# EAGLE schematic Dimmer (EAGLE 9.1.0)
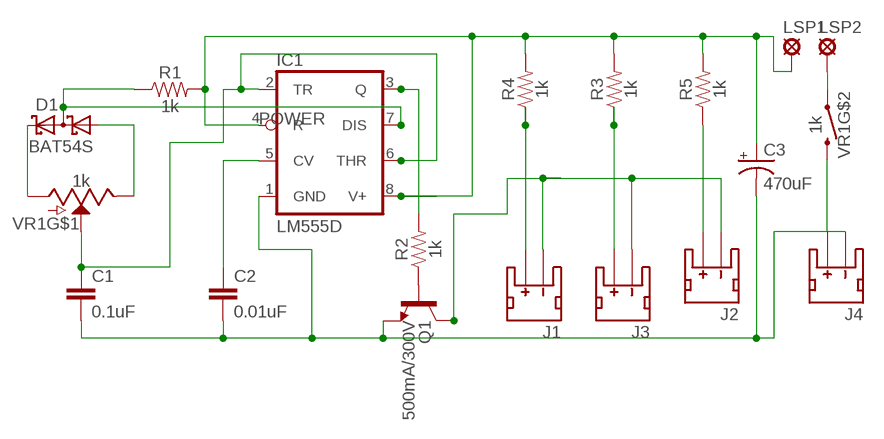
[diagram p0: schematic, sheet 1]

## Parts
C1  0.1uF  C  [C0805]
C2  0.01uF  CC0402  [C0402]
C3  470uF  CPOL-US085CS-1AW  [085CS_1AW]
D1  BAT54S  [SOT23]
IC1  LM555D  [SO08]
J1  JST_2MM_MALE  [JST-2-SMD]
J2  JST_2MM_MALE  [JST-2-SMD]
J3  JST_2MM_MALE  [JST-2-SMD]
J4  JST_2MM_MALE  [JST-2-SMD]
LSP1  LSP10  [LSP10]
LSP2  LSP10  [LSP10]
Q1  500mA/300V  TRANS_NPN-MMBTA42  [SOT23-3]
R1  1k  1KOHM-0603-1/10W-1%  [0603]
R2  1k  1KOHM-0603-1/10W-1%  [0603]
R3  1k  1KOHM-0603-1/10W-1%  [0603]
R4  1k  1KOHM-0603-1/10W-1%  [0603]
R5  1k  1KOHM-0603-1/10W-1%  [0603]
VR1  1k  POTENTIOMETER_W/SWITCHPOT_PTH_SWITCH  [POT-SWITCH-PTH]

## Nets
GND: C1.2 C2.2 C3.- IC1.1(GND) J4.1(-) Q1.2(E)
N$1: D1.1(A1) VR1.3(E)
N$2: D1.2(C2) VR1.1(A)
N$3: D1.3(C1A2) IC1.7(DIS) R1.1
N$4: C2.1 IC1.5(CV)
N$5: C1.1 IC1.2(TR) IC1.6(THR) VR1.2(S)
N$6: Q1.1(B) R2.1
N$7: IC1.3(Q) R2.2
N$8: J1.1(-) J2.1(-) J3.1(-) Q1.3(C)
N$9: J3.2(+) R3.1
N$10: LSP2.MP VR1.S1
N$11: J1.2(+) R4.1
N$12: J2.2(+) R5.1
N$13: J4.2(+) VR1.S2
POWER: C3.+ IC1.4(R) IC1.8(V+) LSP1.MP R1.2 R3.2 R4.2 R5.2
Unconnected: J1.NC1(PAD1) J1.NC2(PAD2) J2.NC1(PAD1) J2.NC2(PAD2) J3.NC1(PAD1) J3.NC2(PAD2) J4.NC1(PAD1) J4.NC2(PAD2)

## Library data of the parts
C1 C2 = eagle-ltspice:C: CAPACITOR, European symbol; SPICEMODEL: NONE; SPICEPREFIX: C
C3 = resistor:CPOL-US: POLARIZED CAPACITOR, American symbol
D1 = diode:BAT54S: Schottky Diodes Pin connection corrected 2011-05-04 Source: Fairchild .. BAT54.pdf
IC1 = linear:*555: TIMER
J1-J4 = SparkFun-Connectors:JST_2MM_MALE: JST 2MM MALE RA CONNECTOR Two pin, compact surface mount connector. Commonly used as a battery input connection point. We really like the solid locking feeling and high current rating on these small connectors. We use these all the time as battery connectors. Mates to single-cell LiPo batteries. Here is the connector we sell at SparkFun: JST Right Angle Connector - White <https://www.sparkfun.com/products/8612> (PRT-08612) Datasheet <http://www.sparkfun.com/datasheets/Prototyping/Connectors/JST-Horizontal.pdf> It was used on these SparkFun products: SparkFun MOSFET Power Controller <https://www.sparkfun.com/products/11214> (PRT-11214) SparkFun Battery Babysitter - LiPo Battery Manager <https://www.sparkfun.com/products/13777> (PRT-13777) And many, many others that required a lipo battery connection.; PROD_ID: CONN-11443; SF_ID: PRT-08612
LSP1 LSP2 = solpad:LSP10: SOLDER PAD drill 1.0 mm, distributor Buerklin, 12H555
Q1 = SparkFun-DiscreteSemi:TRANS_NPN: NPN transistor Current controlled devices typically used to amplify current or used as a switch. BC547 - COM-08928 <http://www.sparkfun.com/products/8928> (TO-92 45V 100mA) (1.Collector 2.Base 3.Emitter) 2N3904 - COM-00521 <http://www.sparkfun.com/products/521> (TO-92 40V 200mA) (1.Emitter 2.Base 3.Collector) P2N2222A - COM-12852 <http://www.sparkfun.com/products/12852> (TO-92 40V 600mA) (1.Collector 2.Base 3.Emitter); PROD_ID: TRANS-09116
R1-R5 = SparkFun-Resistors:1KOHM: 1kΩ resistor A resistor is a passive two-terminal electrical component that implements electrical resistance as a circuit element. Resistors act to reduce current flow, and, at the same time, act to lower voltage levels within circuits. - Wikipedia; PROD_ID: RES-07856
VR1 = SparkFun-Resistors:POTENTIOMETER_W/SWITCH: Potentiometer (Pot) with Switch Three-terminal potentiometers, with an adjustable wiper and two adjustable resistors. A pot can be used to create a configurable voltage divider, or as a variable resistor. This potentiometer includes a "select" switch - actuated by pushing down on the wiper. Variants POT-SWITCH-PTH - 16mm PTH Pot w/ Switch Used on SparkFun FabFM Radio Kit <https://www.sparkfun.com/products/11043>; PROD_ID: RES-11300